# Altium project Vreg_Learning_Platform.PrjPcb (part 4 of 4)

## Sheet Safety.SchDoc: <Project Name>
size A3; ApprovedBy: <Appr.>; Author: <Author>; CompanyName: Infineon Technologies AG; Engineer: <Rel.>; Organization: Infineon Technologies AG; Address1: IFAG DES S PS; Address2: Am Campeon 1-12  -  85579 Neubiberg  -  Germany; Address3: 85579 Neubiberg; Address4: Germany; DocumentNumber: 6; Revision: <Rev.>; SheetNumber: 6; SheetTotal: 9; Release: RC00; PageSetup: Record=PageOptions|CenterHorizontal=True|CenterVertical=True|PrintScale=1.01|XCorrection=1.00|YCorrection=1.00|PrintKind=0|BorderSize=5000000|LeftOffset=0|BottomOffset=0|Orientation=2|PaperLength=1000|PaperWidth=1000|Scale=100|PaperSource=7|PrintQuality=-4|MediaType=1|DitherType=10|PaperKind=A3|PrintScaleMode=1; Doc_ConfidentialStatus: <Doc_ConfidentialStatus>; Doc_Preliminary: <Doc_Preliminary>
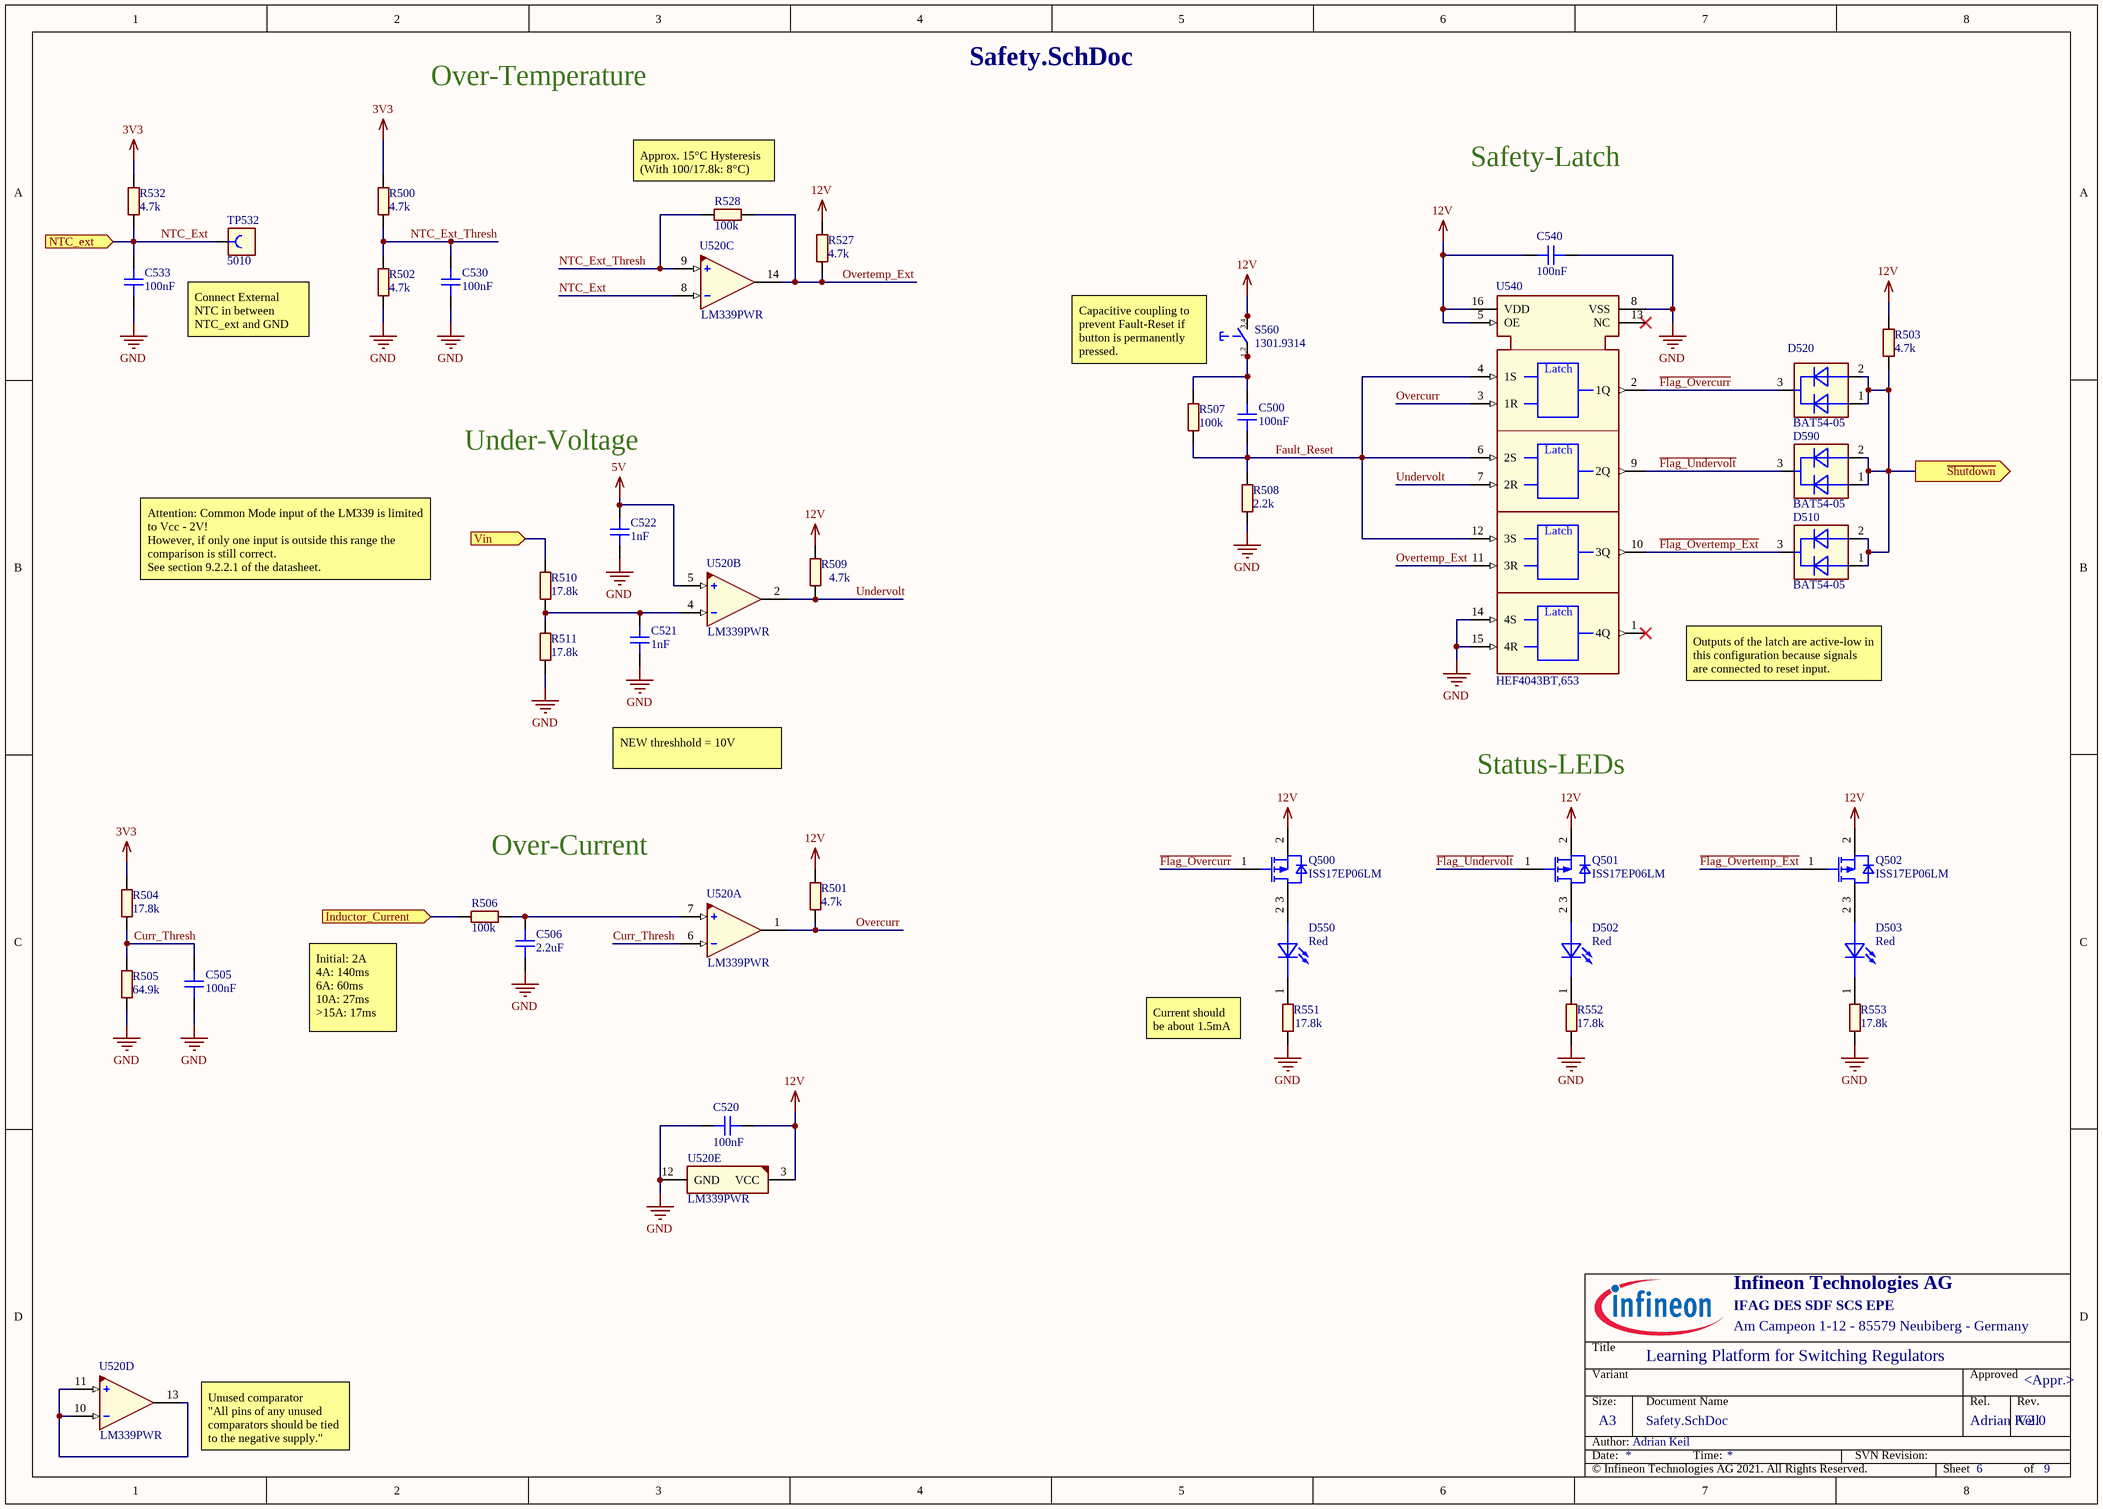
[diagram p4: Safety.SchDoc]

### Parts
C500  100nF  [CAPC1608X90N-2]
C505  100nF  [CAPC1608X90N-2]
C506  2.2uF  [CAPC1608X90N-3]
C520  100nF  [CAPC1608X90N-2]
C521  1nF  [CAPC1608X87N-1]
C522  1nF  [CAPC1608X87N-1]
C530  100nF  [CAPC1608X90N-2]
C533  100nF  [CAPC1608X90N-2]
C540  100nF  [CAPC1608X90N-2]
D502  Red  [LEDSC160X80X80-2N-1]
D503  Red  [LEDSC160X80X80-2N-1]
D510  BAT54-05  [SOT95P240X110-3N-1-V]
D520  BAT54-05  [SOT95P240X110-3N-1-V]
D550  Red  [LEDSC160X80X80-2N-1]
D590  BAT54-05  [SOT95P240X110-3N-1-V]
Q500  ISS17EP06LM  [SOT95P240X110-3N-1-V]
Q501  ISS17EP06LM  [SOT95P240X110-3N-1-V]
Q502  ISS17EP06LM  [SOT95P240X110-3N-1-V]
R500  4.7k  [RESC1609X55N]
R501  4.7k  [RESC1609X55N]
R502  4.7k  [RESC1609X55N]
R503  4.7k  [RESC1609X55N]
R504  17.8k  [RESC1608X60N]
R505  64.9k  [RESC1608X60N]
R506  100k  [RESC1508X60N]
R507  100k  [RESC1508X60N]
R508  2.2k  [RESC1609X50N]
R509  4.7k  [RESC1609X55N]
R510  17.8k  [RESC1608X60N]
R511  17.8k  [RESC1608X60N]
R527  4.7k  [RESC1609X55N]
R528  100k  [RESC1609X50N]
R532  4.7k  [RESC1609X55N]
R551  17.8k  [RESC1608X60N]
R552  17.8k  [RESC1608X60N]
R553  17.8k  [RESC1608X60N]
S560  1301.9314  [SW-SMD-1301.9314]
TP532  5010  [CON-THT-TP-5010]
U520  LM339PWR  [SOP65P640X120-14N-1]  (parts A,B,C,D,E of 5)
U540  HEF4043BT,653  [SOIC127P600X175-16N-6]

### Ports
Inductor_Current (in), NTC_ext (in), Vin (in), ~{Shutdown} (out)

### Nets
3V3: R500.2 R504.2 R532.2
5V: C522.2 U520.5(2IN_P)
12V: C520.1 C540.2 Q500.2(SOURCE) Q501.2(SOURCE) Q502.2(SOURCE) R501.2 R503.2 R509.2 R527.2 S560.3 S560.4 U520.3(VCC) U540.5(OE) U540.16(VDD)
GND: C505.1 C506.1 C520.2 C521.1 C522.1 C530.1 C533.1 C540.1 R502.1 R505.1 R508.2 R511.1 R551.2 R552.1 R553.1 U520.12(GND) U540.8(VSS) U540.14(4S) U540.15(4R)
~{Flag_Overcurr}: D520.3(CATHODE) Q500.1(GATE) U540.2(1Q)
~{Flag_Overtemp_Ext}: D510.3(CATHODE) Q502.1(GATE) U540.10(3Q)
~{Flag_Undervolt}: D590.3(CATHODE) Q501.1(GATE) U540.9(2Q)
~{Shutdown}: D510.1(ANODE_1) D510.2(ANODE_2) D520.1(ANODE_1) D520.2(ANODE_2) D590.1(ANODE_1) D590.2(ANODE_2) R503.1 ; port ~{Shutdown}
Curr_Thresh: C505.2 R504.1 R505.2 U520.6(1IN_N)
Fault_Reset: C500.2 R507.1 R508.1 U540.4(1S) U540.6(2S) U540.12(3S)
Inductor_Current: R506.1 ; port Inductor_Current
NTC_ext: C533.2 R532.1 TP532.1 U520.8(3IN_N) ; port NTC_ext
NTC_Ext_Thresh: C530.2 R500.1 R502.2 R528.2 U520.9(3IN_P)
Overcurr: R501.1 U520.1(1OUT) U540.3(1R)
Overtemp_Ext: R527.1 R528.1 U520.14(3OUT) U540.11(3R)
Undervolt: R509.1 U520.2(2OUT) U540.7(2R)
Vin: R510.1 ; port Vin
NetC500_1: C500.1 R507.2 S560.1 S560.2
NetC506_2: C506.2 R506.2 U520.7(1IN_P)
NetC521_2: C521.2 R510.2 R511.2 U520.4(2IN_N)
NetD502_1: D502.1(Cathode) R552.2
NetD502_2: D502.2(Anode) Q501.3(DRAIN)
NetD503_1: D503.1(Cathode) R553.2
NetD503_2: D503.2(Anode) Q502.3(DRAIN)
NetD550_1: D550.1(Cathode) R551.1
NetD550_2: D550.2(Anode) Q500.3(DRAIN)
NetU520_10: U520.10(4IN_N) U520.11(4IN_P) U520.13(4OUT)

Not connected (* = marked no-connect by the designer): U540 1(4Q)* 13(NC)*

### Notes on the sheet
- Over-Temperature
- (near R528) Approx. 15°C Hysteresis
  (With 100/17.8k: 8°C)
- Safety-Latch
- Connect External NTC in between NTC_ext and GND
- Capacitive coupling to prevent Fault-Reset if button is permanently pressed.
- Under-Voltage
- Attention: Common Mode input of the LM339 is limited to Vcc - 2V!
  However, if only one input is outside this range the comparison is still correct.
  See section 9.2.2.1 of the datasheet.
- Outputs of the latch are active-low in this configuration because signals  are connected to reset input.
- NEW threshhold = 10V
- Status-LEDs
- Over-Current
- Initial: 2A
  4A: 140ms
  6A: 60ms
  10A: 27ms
  >15A: 17ms
- Current should be about 1.5mA
- (near U520) Unused comparator
  "All pins of any unused comparators should be tied to the negative supply."
- Title
- Variant
- Approved
- Date:
- Author:
- Size:
- A3
- Document Name
- Time:
- SVN Revision:
- Rel.
- Rev.
- Sheet
- of
- (in symbol 380147) 3,4; 1,2
- (in symbol 648079) Latch

### Library data of the parts
C500 C505 C520 C530 C533 C540 = 479045: CAP / CERA / 100nF / 50V / 10% / X7R (EIA) / -55°C to 125°C / 0603 / SMD / -; Multiple Parts: No; Manufacturer: AVX; Manufacturer Order Number: 06035C104KAT2A; Symbol Type: Capacitor; Single; Standard; 2 Pins; Alternate View: Yes; Article Number: 479045; Version Number: V01; Combined Parameters: TC:X7R (EIA);Tol.:-10%/+10%;Vdc:50V; QuickPick: 100nF / 50V / 10% / X7R (EIA) / 0603; Type: Standard; Style: Single; ComponentStatus: Released; PLMStatus: Active; Part Type: Capacitor; Value: 100nF; Tolerance Neg: 10%; Tolerance Pos: 10%; Application: Standard; Technology: Ceramic; Temperature min: -55; Temperature max: 125; Temperature Range: Military; ROHS Compliant: Y; Automotive Qualified: No; PackageReference: 0603; ComponentLink1Description: Vendor WebSite; ComponentLink1URL: http://www.avx.com; ComponentLink2Description: Datasheet; ComponentLink2URL: http://webnetprod.muc.infineon.com/PCBPortal_Prod/WorkFlows/AltiumComponent/StandardDocumentation?Versionid=479046; Supplier 1: Farnell; Supplier Part Number 1: 2280883; Supplier 2: DigiKey; Supplier Part Number 2: 478-5052-2-ND; Supplier 3: Mouser; Supplier Part Number 3: 581-06035C104KAT2A; Second Source allowed: Yes; Voltage DC (max): 50V; Package Description: Capacitor,non-polarized,Chip;1.60mm L X 0.81mm W X 0.90mm H
C506 = 310650: CAP / CERA / 2.2uF / 25V / 10% / X5R (EIA) / -55°C to 85°C / 0603(1608) / SMD / -; Multiple Parts: No; Legacy PartNumber: CAP01010924; Manufacturer: MuRata; Manufacturer Order Number: GRM188R61E225KA12D; Symbol Type: Capacitor; Single; Standard; 2 Pins; Alternate View: Yes; Article Number: 310650; Version Number: V01; Combined Parameters: TC:X5R (EIA);Tol.:-10%/+10%;Vdc:25V; QuickPick: 2.2uF / 25V / 10% / X5R (EIA) / 0603 (1608M); Type: Standard; Style: Single; Package Metric: 1608; Package Imperial: 0603; ComponentStatus: Released; PLMStatus: Active; Legacy DeviceID: CAP01010924; Part Type: Capacitor; Value: 2.2uF; Tolerance Neg: 10%; Tolerance Pos: 10%; Technology: Ceramic; Temperature min: -55; Temperature max: 85; Temperature Range: Military; ROHS Compliant: Y; Automotive Qualified: No; PackageReference: 0603 (1608M); ComponentLink1Description: Vendor WebSite; ComponentLink1URL: http://www.murata.com/; ComponentLink2Description: Datasheet; ComponentLink2URL: http://webnetprod.muc.infineon.com/PCBPortal_Prod/WorkFlows/AltiumComponent/StandardDocumentation?Versionid=310651; Supplier 1: Farnell; Supplier Part Number 1: 1845734RL; Supplier 2: DigiKey; Supplier Part Number 2: 490-10731-2-ND; Supplier 3: Mouser; Supplier Part Number 3: 81-GRM188R61E225KA2D; Second Source allowed: Yes; Voltage DC (max): 25V; Package Description: Capacitor,non-polarized,Chip;1.60mm L X 0.80mm W X 0.90mm H
C521 C522 = 527788: CAP / CERA / 1nF / 50V / 10% / X7R (EIA) / -55°C to 125°C / 0603 (1608) / SMD / -; Multiple Parts: No; Manufacturer: Wurth Elektronik; Manufacturer Order Number: 885012206083; Symbol Type: Capacitor; Single; Standard; 2 Pins; Alternate View: Yes; Article Number: 527788; Version Number: V01; Combined Parameters: TC:X7R (EIA);Tol.:-10%/+10%;Vdc:50V; QuickPick: 1nF / 50V / 10% / X7R (EIA) / 0603 (1608); Type: Standard; Style: Single; ComponentStatus: Released; PLMStatus: Active; Part Type: Capacitor; Value: 1nF; Tolerance Neg: 10%; Tolerance Pos: 10%; Application: Standard; Technology: Ceramic; Temperature min: -55; Temperature max: 125; Temperature Range: Military; ROHS Compliant: Y; Automotive Qualified: No; PackageReference: 0603 (1608); ComponentLink1Description: Vendor WebSite; ComponentLink1URL: http://www.we-online.com; ComponentLink2Description: Datasheet; ComponentLink2URL: http://webnetprod.muc.infineon.com/PCBPortal_Prod/WorkFlows/AltiumComponent/StandardDocumentation?Versionid=527789; Supplier 1: Farnell; Supplier Part Number 1: 2495178; Supplier 2: DigiKey; Supplier Part Number 2: 732-8001-1-ND; Supplier 3: Mouser; Supplier Part Number 3: 710-885012206083; Second Source allowed: Yes; Voltage DC (max): 50V; Package Description: Capacitor,non-polarized,Chip;1.60mm L X 0.80mm W X 0.87mm H
D502 D503 D550 = 625459: WL-SMCW SMT Mono-color Chip LED Waterclear, Red,630nm; Manufacturer: Wurth Elektronik; Manufacturer Order Number: 150060RS75000; Symbol Type: Standard LED Symbol, 1 Cathode, 2 Anode; Article Number: 625459; Version Number: V01; Combined Parameters: Vf:2.4V;If:30mA;Ur:5V;Ir:10uA;Pmax:72mW; QuickPick: LED / 1608 (0603); Style: Single; Automotive Qualified: No; ComponentStatus: Released; PLMStatus: Active; Second Source allowed: Yes; Voltage DC (max): na; Part Type: Diode; Value: Red; Type: LED; Application: Standard; Temperature min: -40; Temperature max: 85; Temperature Range: Industrial; ROHS Compliant: Y; PackageReference: 1608 (0603); ComponentLink1Description: Vendor WebSite; ComponentLink1URL: http://www.we-online.com; ComponentLink2Description: Datasheet; ComponentLink2URL: http://webnetprod.muc.infineon.com/PCBPortal_Prod/WorkFlows/AltiumComponent/StandardDocumentation?Versionid=625460; Supplier 1: Farnell; Supplier Part Number 1: 2322071; Supplier 2: DigiKey; Supplier Part Number 2: 732-4978-1-ND; Supplier 3: Mouser; Supplier Part Number 3: 710-150060RS75000; Package Description: LED,Side Concave; 2 pin,1.60mm W X 0.80mm L X 0.80mm H
D510 D520 D590 = 430837: Silicon Schottky Diode, LS(nH) 1.8, VR 30V; Legacy PartNumber: IFX01401370; Manufacturer: Infineon Technologies; Symbol type: Dual Diode Symbol 3 Pins, 1 Anode, 2 Anode, 3 Cathode; Article Number: 430837; Version Number: V01; Combined Parameters: Vf:800mV;If:200mA;Ur:30V;Ir:2uA;Pmax:230mW; QuickPick: Schottky Diode / PG-SOT23-3-11; Style: Dual; Automotive Qualified: AEC Q101; ComponentStatus: Released; PLMStatus: Active; Second Source allowed: Yes; Voltage DC (max): na; Legacy DeviceID: IFX01401370; Part Type: Diode; Manufacturer Order Number: BAT54-05; Value: BAT54-05; Type: Schottky Diode; Application: Standard; Temperature min: 0; Temperature max: 150; Temperature Range: Military; ROHS Compliant: Y; PackageReference: PG-SOT23-3-11; ComponentLink1Description: Vendor WebSite; ComponentLink1URL: https://www.infineon.com/; ComponentLink2Description: Datasheet; ComponentLink2URL: http://webnetprod.muc.infineon.com/PCBPortal_Prod/WorkFlows/AltiumComponent/StandardDocumentation?Versionid=430838; Supplier 1: Farnell; Supplier Part Number 1: 2725759; Supplier 2: DigiKey; Supplier Part Number 2: BAT5405E6327HTSA1TR-ND; Supplier 3: Mouser; Supplier Part Number 3: 726-BAT5405E6327HTSA; Package Description: SOT,0.95mm pitch;3 pin,1.30mm W X 2.90mm L X 1.10mm H body
Q500-Q502 = 615536: OptiMOSTM Small Signal Transistor, -60 V; Manufacturer: Infineon Technologies; Symbol Type: Insulated-Gate Field-Effect Transistor (IGFET), P-Channel, Enhancement,  Body Diode, Pin 1 Gate, 2 Source, 3 Drain, 3 Pins; Article Number: 615536; Version Number: V01; Legacy DeviceID: IFX_ISS17EP06LM; Combined Parameters: P-Channel Enhancement;Uds:-60V;Id:-300mA;Rds:1.7R;P:360mW; QuickPick: P-Channel Enhancement / 360mW / -300mA / -60V / PG-SOT23-3-5; Type: P-Channel Enhancement; Style: Single; Automotive Qualified: No; ComponentStatus: Released; PLMStatus: Active; Second Source allowed: Yes; Voltage DC (max): na; Part Type: Transistor FET; Manufacturer Order Number: ISS17EP06LM; Value: ISS17EP06LM; Application: Small Signal; Temperature min: -55; Temperature max: 150; Temperature Range: Military; ROHS Compliant: Y; PackageReference: PG-SOT23-3-5; ComponentLink1Description: Vendor WebSite; ComponentLink1URL: https://www.infineon.com/; ComponentLink2Description: Datasheet; ComponentLink2URL: http://webnetprod.muc.infineon.com/PCBPortal_Prod/WorkFlows/AltiumComponent/StandardDocumentation?Versionid=615537; Supplier 1: Farnell; Supplier Part Number 1: 3267800; Supplier 2: DigiKey; Supplier Part Number 2: 448-ISS17EP06LMXTSA1CT-ND; Supplier 3: Mouser; Supplier Part Number 3: 726-ISS17EP06LMXTSA1; Package Description: SOT,0.95mm,pitch;3 pin,1.30mm W X 2.90mm L X 1.10mm H body
R500-R503 R509 R527 R532 = 699381: RES / STD / 4.7k / 100mW / 1% / 100ppm/K / -55°C to 155°C / 1.60mm L X 0.85mm W X 0.55mm H / - / -; Multiple Parts: No; Manufacturer: Panasonic; Manufacturer Order Number: ERJ3EKF4701V; Symbol Type: Resistor; Single; Standard; 2 Pins; Alternate View: Yes; Article Number: 699381; Version Number: V00; Combined Parameters: TCR:100ppm/K;Tol.:-1%/+1%;Vdc:-;Idc:-;P:100mW; QuickPick: 4.7k / 1% / 0.1 / ERJ3EKF4701V; Style: Single; Automotive Qualified: AEC Q200; ComponentStatus: Released; PLMStatus: Active; Part Type: Resistor; Value: 4.7k; Tolerance Neg: 1%; Tolerance Pos: 1%; Type: Standard; Application: Standard; Technology: Thick Film; Temperature min: -55; Temperature max: 155; Temperature Range: Military; ROHS Compliant: Y; PackageReference: ERJ3EKF4701V; ComponentLink1Description: Vendor WebSite; ComponentLink1URL: http://panasonic.net/sanyo/index.html; ComponentLink2Description: Datasheet; ComponentLink2URL: http://webnetprod.muc.infineon.com/PCBPortal_Prod/WorkFlows/AltiumComponent/StandardDocumentation?Versionid=699382; Supplier 1: Farnell; Supplier Part Number 1: 2303181; Supplier 2: DigiKey; Supplier Part Number 2: P4.70KHCT-ND; Supplier 3: Mouser; Supplier Part Number 3: 667-ERJ-3EKF4701V; Second Source allowed: Yes; Package Description: Resistor,Chip;1.60mm L X 0.85mm W X 0.55mm H
R504 R510 R511 R551-R553 = 699489: RES / STD / 17.8k / 100mW / 1% / 100ppm/K / -55°C to 155°C / 1.60mm L X 0.80mm W X 0.60mm H / - / -; Multiple Parts: No; Manufacturer: Multicomp; Manufacturer Order Number: MCWR06X1782FTL; Symbol Type: Resistor; Single; Standard; 2 Pins; Alternate View: Yes; Article Number: 699489; Version Number: V00; Combined Parameters: TCR:100ppm/K;Tol.:-1%/+1%;Vdc:-;Idc:-;P:100mW; QuickPick: 17.8k / 1% / 0.1 / MCWR06X1782FTL; Style: Single; ComponentStatus: Released; PLMStatus: Active; Part Type: Resistor; Value: 17.8k; Tolerance Neg: 1%; Tolerance Pos: 1%; Type: Standard; Application: Standard; Technology: Thick Film; Temperature min: -55; Temperature max: 155; Temperature Range: Military; ROHS Compliant: Y; Automotive Qualified: No; PackageReference: MCWR06X1782FTL; ComponentLink1Description: Vendor WebSite; ComponentLink1URL: http://www.farnellinone.com; ComponentLink2Description: Datasheet; ComponentLink2URL: http://webnetprod.muc.infineon.com/PCBPortal_Prod/WorkFlows/AltiumComponent/StandardDocumentation?Versionid=699490; Supplier 1: Farnell; Supplier Part Number 1: 2447265; Supplier 2: DigiKey; Supplier 3: Mouser; Second Source allowed: Yes; Package Description: Resistor,Chip;1.60mm L X 0.80mm W X 0.60mm H
R505 = 699501: RES / STD / 64.9k / 100mW / 1% / 100ppm/K / -55°C to 155°C / 1.60mm L X 0.80mm W X 0.60mm H / - / -; Multiple Parts: No; Manufacturer: Multicomp; Manufacturer Order Number: MCWR06X6492FTL; Symbol Type: Resistor; Single; Standard; 2 Pins; Alternate View: Yes; Article Number: 699501; Version Number: V00; Combined Parameters: TCR:100ppm/K;Tol.:-1%/+1%;Vdc:-;Idc:-;P:100mW; QuickPick: 64.9k / 1% / 0.1 / MCWR06X6492FTL; Style: Single; ComponentStatus: Released; PLMStatus: Active; Part Type: Resistor; Value: 64.9k; Tolerance Neg: 1%; Tolerance Pos: 1%; Type: Standard; Application: Standard; Technology: Thick Film; Temperature min: -55; Temperature max: 155; Temperature Range: Military; ROHS Compliant: Y; Automotive Qualified: No; PackageReference: MCWR06X6492FTL; ComponentLink1Description: Vendor WebSite; ComponentLink1URL: http://www.farnellinone.com; ComponentLink2Description: Datasheet; ComponentLink2URL: http://webnetprod.muc.infineon.com/PCBPortal_Prod/WorkFlows/AltiumComponent/StandardDocumentation?Versionid=699502; Supplier 1: Farnell; Supplier Part Number 1: 2447417RL; Supplier 2: DigiKey; Supplier 3: Mouser; Second Source allowed: Yes; Package Description: Resistor,Chip;1.60mm L X 0.80mm W X 0.60mm H
R506 R507 = 699383: RES / STD / 100k / 100mW / 0.1% / 25ppm/K / -55°C to 155°C / 1.55mm L X 0.80mm W X 0.60mm H / - / -; Multiple Parts: No; Manufacturer: Bourns; Manufacturer Order Number: CRT0603-BY-1003ELF; Symbol Type: Resistor; Single; Standard; 2 Pins; Alternate View: Yes; Article Number: 699383; Version Number: V00; Combined Parameters: TCR:25ppm/K;Tol.:-0.1%/+0.1%;Vdc:150V;Idc:-;P:100mW; QuickPick: 100k / 0.1% / 0.1 / CRT0603-BY-1003ELF; Style: Single; ComponentStatus: Released; PLMStatus: Active; Voltage DC (max): 150V; Part Type: Resistor; Value: 100k; Tolerance Neg: 0.1%; Tolerance Pos: 0.1%; Type: Standard; Application: Precision; Technology: Thin Film; Temperature min: -55; Temperature max: 155; Temperature Range: Military; ROHS Compliant: Y; Automotive Qualified: No; PackageReference: CRT0603-BY-1003ELF; ComponentLink1Description: Vendor WebSite; ComponentLink1URL: http://www.bourns.com; ComponentLink2Description: Datasheet; ComponentLink2URL: http://webnetprod.muc.infineon.com/PCBPortal_Prod/WorkFlows/AltiumComponent/StandardDocumentation?Versionid=699384; Supplier 1: Farnell; Supplier Part Number 1: 2008311; Supplier 2: DigiKey; Supplier Part Number 2: CRT0603-BY-1003ELFCT-ND; Supplier 3: Mouser; Supplier Part Number 3: 652-CRT0603BY1003ELF; Second Source allowed: Yes; Package Description: Resistor,Chip;1.55mm L X 0.80mm W X 0.60mm H
R508 = 345782: RES / STD / 2.2k / 100mW / 1% / 100ppm/K / -55°C to 155°C / 0603 / SMD / -; Multiple Parts: No; Legacy PartNumber: RES01801179; Manufacturer: Vishay; Manufacturer Order Number: CRCW06032K20FK; Symbol Type: Resistor; Single; Standard; 2 Pins; Alternate View: Yes; Article Number: 345782; Version Number: V01; Combined Parameters: TCR:100ppm/K;Tol.:-1%/+1%;Vdc:75V;Idc:-;P:100mW; QuickPick: 2.2k / 1% / 0.1 / 0603; Style: Single; Automotive Qualified: AEC Q200; ComponentStatus: Released; PLMStatus: Active; Voltage DC (max): 75V; Legacy DeviceID: RES01801179; Part Type: Resistor; Value: 2.2k; Tolerance Neg: 1%; Tolerance Pos: 1%; Type: Standard; Technology: Thick Film; Temperature min: -55; Temperature max: 155; Temperature Range: Military; ROHS Compliant: Y; PackageReference: 0603; ComponentLink1Description: Vendor WebSite; ComponentLink1URL: http://www.vishay.com; ComponentLink2Description: Datasheet; ComponentLink2URL: http://webnetprod.muc.infineon.com/PCBPortal_Prod/WorkFlows/AltiumComponent/StandardDocumentation?Versionid=345783; Supplier 1: Farnell; Supplier 2: DigiKey; Supplier 3: Mouser; Second Source allowed: Yes
R528 = 346742: RES / STD / 100k / 100mW / 1% / 100ppm/K / -55°C to 155°C / 0603 / SMD / -; Multiple Parts: No; Legacy PartNumber: RES01801371; Manufacturer: Vishay; Manufacturer Order Number: CRCW0603100KFK; Symbol Type: Resistor; Single; Standard; 2 Pins; Alternate View: Yes; Article Number: 346742; Version Number: V01; Combined Parameters: TCR:100ppm/K;Tol.:-1%/+1%;Vdc:75V;Idc:-;P:100mW; QuickPick: 100k / 1% / 0.1 / 0603; Style: Single; Automotive Qualified: AEC Q200; ComponentStatus: Released; PLMStatus: Active; Voltage DC (max): 75V; Legacy DeviceID: RES01801371; Part Type: Resistor; Value: 100k; Tolerance Neg: 1%; Tolerance Pos: 1%; Type: Standard; Technology: Thick Film; Temperature min: -55; Temperature max: 155; Temperature Range: Military; ROHS Compliant: Y; PackageReference: 0603; ComponentLink1Description: Vendor WebSite; ComponentLink1URL: http://www.vishay.com; ComponentLink2Description: Datasheet; ComponentLink2URL: http://webnetprod.muc.infineon.com/PCBPortal_Prod/WorkFlows/AltiumComponent/StandardDocumentation?Versionid=346743; Supplier 1: Farnell; Supplier Part Number 1: 1469649; Supplier 2: DigiKey; Supplier 3: Mouser; Second Source allowed: Yes
S560 = 380147: Pushbutton Tactile Switch, Single Pole Single Throw, 4 Pins; Legacy PartNumber: CON01500305; Manufacturer: Schurter; Symbol type: Tactile Switch, Spring Return, Single Pole Single Throw - Normally Open, 4 Pins; Article Number: 380147; Version Number: V01; Legacy DeviceID: SCH_1301.9314; ComponentStatus: Released; PLMStatus: Active; Second Source allowed: Yes; Voltage DC (max): na; Part Type: Electro Mechanic; Manufacturer Order Number: 1301.9314; Value: 1301.9314; Temperature min: -20; Temperature max: 70; Temperature Range: Commercial; ROHS Compliant: Y; ComponentLink1Description: Vendor WebSite; ComponentLink1URL: http://www.schurter.com.sg/; ComponentLink2Description: Datasheet; ComponentLink2URL: http://webnetprod.muc.infineon.com/PCBPortal_Prod/WorkFlows/AltiumComponent/StandardDocumentation?Versionid=380148; Supplier 1: Farnell; Supplier Part Number 1: 1217763; Supplier 2: DigiKey; Supplier Part Number 2: 1301.9314-ND; Supplier 3: Mouser; Supplier Part Number 3: 693-1301.9314; Package Description: SMD Switch, 6.00mm L X 6.00mm W X 4.3mm H body
TP532 = 382400: PC Test Point-Multipurpose THT, Red; Multiple Parts: No; Legacy PartNumber: CON01500529; Manufacturer: Keystone Electronics Corp.; Symbol Type: Connector, 1 Lead, Female; Alternate View: Yes; Article Number: 382400; Version Number: V01; Legacy DeviceID: KEY_5010; Combined Parameters: Board-to-Cable None (onboard);1x1;Mounting:THT;Orient:0° (vertical);Shielded:No; QuickPick: 0° (vertical) / Board-to-Cable; Style: Not Applicable; ComponentStatus: Released; PLMStatus: Active; Voltage DC (max): na; Part Type: Connector; Manufacturer Order Number: 5010; Value: 5010; Type: Board-to-Cable; Application: Test; Temperature min: 0; Temperature max: 0; Temperature Range: Military; ROHS Compliant: Y; Automotive Qualified: No; ComponentLink1Description: Vendor WebSite; ComponentLink1URL: http://www.keyelco.com/; ComponentLink2Description: Datasheet; ComponentLink2URL: http://webnetprod.muc.infineon.com/PCBPortal_Prod/WorkFlows/AltiumComponent/StandardDocumentation?Versionid=382401; Supplier 1: Farnell; Supplier Part Number 1: 2301288; Supplier 2: DigiKey; Supplier Part Number 2: 36-5010-ND; Supplier 3: Mouser; Supplier Part Number 3: 534-5010; Second Source allowed: Yes; Package Description: Test Point, 1.78 mm Lead Width, Round, 3.17 mm Dia X 8.28 mm H body
U520 = 409035: Quad Differential Comparator; Legacy PartNumber: IC02600564; Manufacturer: Texas Instruments; Alternate View: Yes; Article Number: 409035; Version Number: V01; Legacy DeviceID: TI_LM339; Combined Parameters: Res.:-;Fmax:-; QuickPick: TSSOP-14 (PW); Automotive Qualified: No; ComponentStatus: Released; PLMStatus: Active; Voltage DC (max): na; Symbol Type: Quad Differential Comparator; Part Type: Analog Parts; Manufacturer Order Number: LM339PWR; Value: LM339PWR; Temperature min: 0; Temperature max: 0; Temperature Range: Military; PackageReference: TSSOP-14 (PW); ComponentLink1Description: Vendor WebSite; ComponentLink1URL: http://www.ti.com; ComponentLink2Description: Datasheet; ComponentLink2URL: http://webnetprod.muc.infineon.com/PCBPortal_Prod/WorkFlows/AltiumComponent/StandardDocumentation?Versionid=409036; Supplier 1: Farnell; Supplier Part Number 1: 2436009; Supplier 2: DigiKey; Supplier Part Number 2: 296-6607-2-ND; Supplier 3: Mouser; Supplier Part Number 3: 595-LM339PWR; Second Source allowed: Yes
U540 = 648079: Quad R/S latch with 3-state outputs; Multiple Parts: No; Manufacturer: Nexperia; Article Number: 648079; Version Number: V00; Legacy DeviceID: NEX_HEF4043BT,653; Combined Parameters: - Digital;Vdc min/max:3V/15V;Iout:2.4mA;Fmax:-; QuickPick: SO-16; ComponentStatus: Released; PLMStatus: Active; Second Source allowed: Yes; Voltage DC (max): na; Symbol Type: Quad R/S latch with 3-state outputs; Alternate View: No; Part Type: Integrated Circuit; Manufacturer Order Number: HEF4043BT,653; Value: HEF4043BT,653; Type: Digital; Temperature min: -40; Temperature max: 85; Temperature Range: Industrial; ROHS Compliant: Y; Automotive Qualified: No; PackageReference: SO-16; ComponentLink1Description: Vendor WebSite; ComponentLink1URL: http://www.nexperia.com; ComponentLink2Description: Datasheet; ComponentLink2URL: http://webnetprod.muc.infineon.com/PCBPortal_Prod/WorkFlows/AltiumComponent/StandardDocumentation?Versionid=648080; Supplier 1: Farnell; Supplier 2: DigiKey; Supplier Part Number 2: 1727-1799-1-ND; Supplier 3: Mouser; Supplier Part Number 3: 771-HEF4043BT653; Package Description: SOIC,1.27mm pitch;16 pin,3.90mm W X 9.90mm L X 1.75mm H body

## Sheet Miscellaneous.SchDoc: <Project Name>
size A3; ApprovedBy: <Appr.>; Author: <Author>; CompanyName: Infineon Technologies AG; Engineer: <Rel.>; Organization: Infineon Technologies AG; Address1: IFAG DES S PS; Address2: Am Campeon 1-12  -  85579 Neubiberg  -  Germany; Address3: 85579 Neubiberg; Address4: Germany; DocumentNumber: 9; Revision: <Rev.>; SheetNumber: 9; SheetTotal: 9; Release: RC00; PageSetup: Record=PageOptions|CenterHorizontal=True|CenterVertical=True|PrintScale=1.01|XCorrection=1.00|YCorrection=1.00|PrintKind=0|BorderSize=5000000|LeftOffset=0|BottomOffset=0|Orientation=2|PaperLength=1000|PaperWidth=1000|Scale=100|PaperSource=7|PrintQuality=-4|MediaType=1|DitherType=10|PaperKind=A3|PrintScaleMode=1; Doc_ConfidentialStatus: <Doc_ConfidentialStatus>; Doc_Preliminary: <Doc_Preliminary>
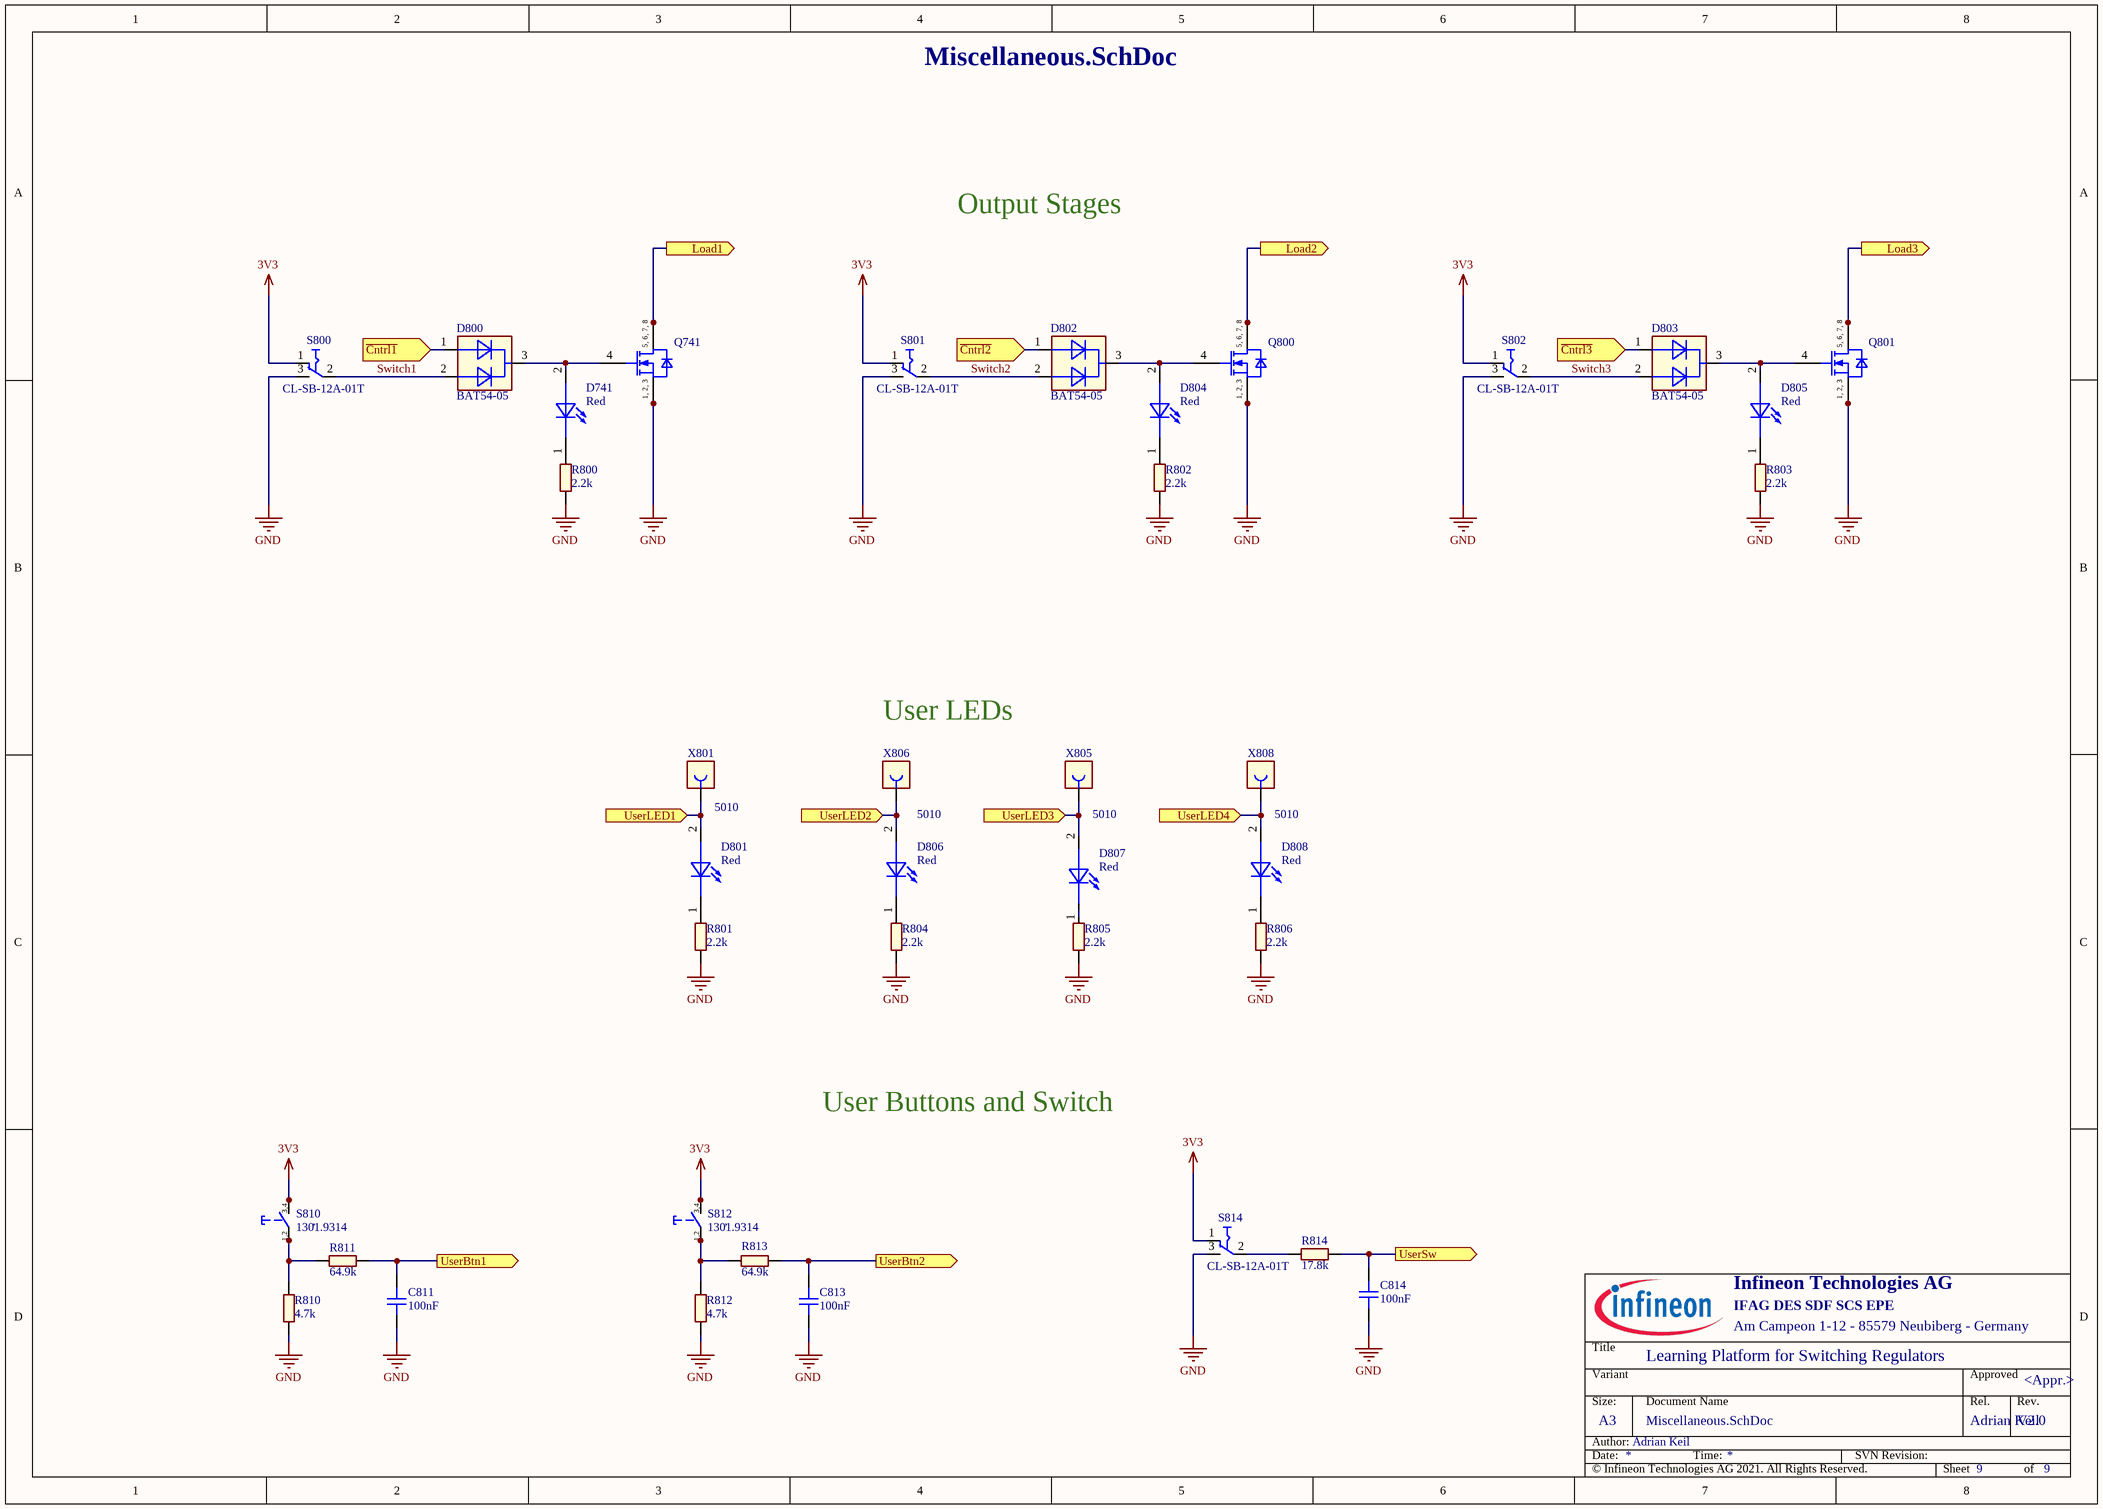
[diagram p5: Miscellaneous.SchDoc]

### Parts
C811  100nF  [CAPC1608X90N-2]
C813  100nF  [CAPC1608X90N-2]
C814  100nF  [CAPC1608X90N-2]
D741  Red  [LEDSC160X80X80-2N-1]
D800  BAT54-05  [SOT95P240X110-3N-1-V]
D801  Red  [LEDSC160X80X80-2N-1]
D802  BAT54-05  [SOT95P240X110-3N-1-V]
D803  BAT54-05  [SOT95P240X110-3N-1-V]
D804  Red  [LEDSC160X80X80-2N-1]
D805  Red  [LEDSC160X80X80-2N-1]
D806  Red  [LEDSC160X80X80-2N-1]
D807  Red  [LEDSC160X80X80-2N-1]
D808  Red  [LEDSC160X80X80-2N-1]
Q741  igfet_n_ch_enh_dio_1s2s3s4g5d6d7d8d_8p  [IFX-PG-TDSON-8-6-V]  (value not drawn)
Q800  igfet_n_ch_enh_dio_1s2s3s4g5d6d7d8d_8p  [IFX-PG-TDSON-8-6-V]  (value not drawn)
Q801  igfet_n_ch_enh_dio_1s2s3s4g5d6d7d8d_8p  [IFX-PG-TDSON-8-6-V]  (value not drawn)
R800  2.2k  [RESC1609X50N]
R801  2.2k  [RESC1609X50N]
R802  2.2k  [RESC1609X50N]
R803  2.2k  [RESC1609X50N]
R804  2.2k  [RESC1609X50N]
R805  2.2k  [RESC1609X50N]
R806  2.2k  [RESC1609X50N]
R810  4.7k  [RESC1609X55N]
R811  64.9k  [RESC1608X60N]
R812  4.7k  [RESC1609X55N]
R813  64.9k  [RESC1608X60N]
R814  17.8k  [RESC1608X60N]
S800  CL-SB-12A-01T  [SW-SMD-CL-SB-12A-01T]
S801  CL-SB-12A-01T  [SW-SMD-CL-SB-12A-01T]
S802  CL-SB-12A-01T  [SW-SMD-CL-SB-12A-01T]
S810  1301.9314  [SW-SMD-1301.9314]
S812  1301.9314  [SW-SMD-1301.9314]
S814  CL-SB-12A-01T  [SW-SMD-CL-SB-12A-01T]
X801  5010  [CON-THT-TP-5010]
X805  5010  [CON-THT-TP-5010]
X806  5010  [CON-THT-TP-5010]
X808  5010  [CON-THT-TP-5010]

### Ports
Load1 (out), Load2 (out), Load3 (out), UserBtn1 (out), UserBtn2 (out), UserLED1 (in), UserLED2 (in), UserLED3 (in), UserLED4 (in), UserSw (out), ~{Cntrl1} (in), ~{Cntrl2} (in), ~{Cntrl3} (in)

### Nets
3V3: S800.1 S801.1 S802.1 S810.3 S810.4 S812.3 S812.4 S814.1
GND: C811.1 C813.1 C814.1 Q741.1(SOURCE) Q741.2(SOURCE) Q741.3(SOURCE) Q800.1(SOURCE) Q800.2(SOURCE) Q800.3(SOURCE) Q801.1(SOURCE) Q801.2(SOURCE) Q801.3(SOURCE) R800.2 R801.2 R802.2 R803.2 R804.2 R805.2 R806.2 R810.2 R812.2 S800.3 S801.3 S802.3 S814.3
~{Cntrl1}: D800.1(ANODE_1) ; port ~{Cntrl1}
~{Cntrl2}: D802.1(ANODE_1) ; port ~{Cntrl2}
~{Cntrl3}: D803.1(ANODE_1) ; port ~{Cntrl3}
Load1: Q741.5(DRAIN) Q741.6(DRAIN) Q741.7(DRAIN) Q741.8(DRAIN) ; port Load1
Load2: Q800.5(DRAIN) Q800.6(DRAIN) Q800.7(DRAIN) Q800.8(DRAIN) ; port Load2
Load3: Q801.5(DRAIN) Q801.6(DRAIN) Q801.7(DRAIN) Q801.8(DRAIN) ; port Load3
Switch1: D800.2(ANODE_2) S800.2
Switch2: D802.2(ANODE_2) S801.2
Switch3: D803.2(ANODE_2) S802.2
UserBtn1: C811.2 R811.2 ; port UserBtn1
UserBtn2: C813.2 R813.2 ; port UserBtn2
UserLED1: D801.2(Anode) X801.1 ; port UserLED1
UserLED2: D806.2(Anode) X806.1 ; port UserLED2
UserLED3: D807.2(Anode) X805.1 ; port UserLED3
UserLED4: D808.2(Anode) X808.1 ; port UserLED4
UserSw: C814.2 R814.2 ; port UserSw
NetD741_1: D741.1(Cathode) R800.1
NetD741_2: D741.2(Anode) D800.3(CATHODE) Q741.4(GATE)
NetD801_1: D801.1(Cathode) R801.1
NetD802_3: D802.3(CATHODE) D804.2(Anode) Q800.4(GATE)
NetD803_3: D803.3(CATHODE) D805.2(Anode) Q801.4(GATE)
NetD804_1: D804.1(Cathode) R802.1
NetD805_1: D805.1(Cathode) R803.1
NetD806_1: D806.1(Cathode) R804.1
NetD807_1: D807.1(Cathode) R805.1
NetD808_1: D808.1(Cathode) R806.1
NetR810_1: R810.1 R811.1 S810.1 S810.2
NetR812_1: R812.1 R813.1 S812.1 S812.2
NetR814_1: R814.1 S814.2

### Notes on the sheet
- Output Stages
- User LEDs
- User Buttons and Switch
- ,
- Title
- Variant
- Approved
- Date:
- Author:
- Size:
- A3
- Document Name
- Time:
- SVN Revision:
- Rel.
- Rev.
- Sheet
- of
- (in symbol 380147) 3,4; 1,2
- (in symbol 691273) 5, 6, 7, 8; 1, 2, 3

### Library data of the parts
C811 C813 C814 = 479045: as C500 on sheet Safety; Part Type: Capacitor; Value: 100nF; Tolerance Neg: 10%; Tolerance Pos: 10%; Application: Standard; Technology: Ceramic; Temperature min: -55; Temperature max: 125; Temperature Range: Military; ROHS Compliant: Y; Automotive Qualified: No; PackageReference: 0603; ComponentLink1Description: Vendor WebSite; ComponentLink1URL: http://www.avx.com; ComponentLink2Description: Datasheet; ComponentLink2URL: http://webnetprod.muc.infineon.com/PCBPortal_Prod/WorkFlows/AltiumComponent/StandardDocumentation?Versionid=479046; Supplier 1: Farnell; Supplier Part Number 1: 2280883; Supplier 2: DigiKey; Supplier Part Number 2: 478-5052-2-ND; Supplier 3: Mouser; Supplier Part Number 3: 581-06035C104KAT2A; Second Source allowed: Yes; Voltage DC (max): 50V; Package Description: Capacitor,non-polarized,Chip;1.60mm L X 0.81mm W X 0.90mm H
D741 D801 D804-D808 = 625459: as D502 on sheet Safety; Part Type: Diode; Value: Red; Type: LED; Application: Standard; Temperature min: -40; Temperature max: 85; Temperature Range: Industrial; ROHS Compliant: Y; PackageReference: 1608 (0603); ComponentLink1Description: Vendor WebSite; ComponentLink1URL: http://www.we-online.com; ComponentLink2Description: Datasheet; ComponentLink2URL: http://webnetprod.muc.infineon.com/PCBPortal_Prod/WorkFlows/AltiumComponent/StandardDocumentation?Versionid=625460; Supplier 1: Farnell; Supplier Part Number 1: 2322071; Supplier 2: DigiKey; Supplier Part Number 2: 732-4978-1-ND; Supplier 3: Mouser; Supplier Part Number 3: 710-150060RS75000; Package Description: LED,Side Concave; 2 pin,1.60mm W X 0.80mm L X 0.80mm H
D800 D802 D803 = 430837: as D510 on sheet Safety; Legacy DeviceID: IFX01401370; Part Type: Diode; Manufacturer Order Number: BAT54-05; Value: BAT54-05; Type: Schottky Diode; Application: Standard; Temperature min: 0; Temperature max: 150; Temperature Range: Military; ROHS Compliant: Y; PackageReference: PG-SOT23-3-11; ComponentLink1Description: Vendor WebSite; ComponentLink1URL: https://www.infineon.com/; ComponentLink2Description: Datasheet; ComponentLink2URL: http://webnetprod.muc.infineon.com/PCBPortal_Prod/WorkFlows/AltiumComponent/StandardDocumentation?Versionid=430838; Supplier 1: Farnell; Supplier Part Number 1: 2725759; Supplier 2: DigiKey; Supplier Part Number 2: BAT5405E6327HTSA1TR-ND; Supplier 3: Mouser; Supplier Part Number 3: 726-BAT5405E6327HTSA; Package Description: SOT,0.95mm pitch;3 pin,1.30mm W X 2.90mm L X 1.10mm H body
Q741 Q800 Q801 = 691273: OptiMOS Power MOSFET, 30V; Manufacturer: Infineon Technologies; Manufacturer Order Number: BSC0906NS; Symbol Type: Insulated-Gate Field-Effect Transistor (IGFET), N-Channel, Enhancement, Body Diode, Pin 1 Source, 2 Source, 3 Source, 4 Gate, 5 Drain, 6 Drain, 7 Drain, 8 Drain, 8 Pins; Article Number: 691273; Version Number: V00; Legacy DeviceID: IFX_BSC0906NS; Value: BSC0906NS; Combined Parameters: N-Channel Enhancement;Uds:30V;Id:63A;Rds:4.5R;P:30W; QuickPick: N-Channel Enhancement / 30W / 63A / 30V / TDSON-8; Type: N-Channel Enhancement; Style: Single; Automotive Qualified: No; ComponentStatus: Released; PLMStatus: Active; Second Source allowed: Yes; Voltage DC (max): na; Part Type: Transistor FET; Application: Power Electronics; Temperature min: -55; Temperature max: 150; Temperature Range: Military; ROHS Compliant: Y; PackageReference: TDSON-8; ComponentLink1Description: Vendor WebSite; ComponentLink1URL: https://www.infineon.com/; ComponentLink2Description: Datasheet; ComponentLink2URL: http://webnetprod.muc.infineon.com/PCBPortal_Prod/WorkFlows/AltiumComponent/StandardDocumentation?Versionid=691274; Supplier 1: Farnell; Supplier Part Number 1: 2480745; Supplier 2: DigiKey; Supplier Part Number 2: BSC0906NSATMA1CT-ND; Supplier 3: Mouser; Supplier Part Number 3: 726-BSC0906NS; Package Description: PG-TDSON-8-6, SMD, 1.27 mm pitch, 8 pin, 5.90 mm W X 5.075 mm L X 1.20 mm H body
R800-R806 = 345782: as R508 on sheet Safety; Legacy DeviceID: RES01801179; Part Type: Resistor; Value: 2.2k; Tolerance Neg: 1%; Tolerance Pos: 1%; Type: Standard; Technology: Thick Film; Temperature min: -55; Temperature max: 155; Temperature Range: Military; ROHS Compliant: Y; PackageReference: 0603; ComponentLink1Description: Vendor WebSite; ComponentLink1URL: http://www.vishay.com; ComponentLink2Description: Datasheet; ComponentLink2URL: http://webnetprod.muc.infineon.com/PCBPortal_Prod/WorkFlows/AltiumComponent/StandardDocumentation?Versionid=345783; Supplier 1: Farnell; Supplier 2: DigiKey; Supplier 3: Mouser; Second Source allowed: Yes
R810 R812 = 699381: as R500 on sheet Safety; Part Type: Resistor; Value: 4.7k; Tolerance Neg: 1%; Tolerance Pos: 1%; Type: Standard; Application: Standard; Technology: Thick Film; Temperature min: -55; Temperature max: 155; Temperature Range: Military; ROHS Compliant: Y; PackageReference: ERJ3EKF4701V; ComponentLink1Description: Vendor WebSite; ComponentLink1URL: http://panasonic.net/sanyo/index.html; ComponentLink2Description: Datasheet; ComponentLink2URL: http://webnetprod.muc.infineon.com/PCBPortal_Prod/WorkFlows/AltiumComponent/StandardDocumentation?Versionid=699382; Supplier 1: Farnell; Supplier Part Number 1: 2303181; Supplier 2: DigiKey; Supplier Part Number 2: P4.70KHCT-ND; Supplier 3: Mouser; Supplier Part Number 3: 667-ERJ-3EKF4701V; Second Source allowed: Yes; Package Description: Resistor,Chip;1.60mm L X 0.85mm W X 0.55mm H
R811 R813 = 699501: as R505 on sheet Safety; Part Type: Resistor; Value: 64.9k; Tolerance Neg: 1%; Tolerance Pos: 1%; Type: Standard; Application: Standard; Technology: Thick Film; Temperature min: -55; Temperature max: 155; Temperature Range: Military; ROHS Compliant: Y; Automotive Qualified: No; PackageReference: MCWR06X6492FTL; ComponentLink1Description: Vendor WebSite; ComponentLink1URL: http://www.farnellinone.com; ComponentLink2Description: Datasheet; ComponentLink2URL: http://webnetprod.muc.infineon.com/PCBPortal_Prod/WorkFlows/AltiumComponent/StandardDocumentation?Versionid=699502; Supplier 1: Farnell; Supplier Part Number 1: 2447417RL; Supplier 2: DigiKey; Supplier 3: Mouser; Second Source allowed: Yes; Package Description: Resistor,Chip;1.60mm L X 0.80mm W X 0.60mm H
R814 = 699489: as R504 on sheet Safety; Part Type: Resistor; Value: 17.8k; Tolerance Neg: 1%; Tolerance Pos: 1%; Type: Standard; Application: Standard; Technology: Thick Film; Temperature min: -55; Temperature max: 155; Temperature Range: Military; ROHS Compliant: Y; Automotive Qualified: No; PackageReference: MCWR06X1782FTL; ComponentLink1Description: Vendor WebSite; ComponentLink1URL: http://www.farnellinone.com; ComponentLink2Description: Datasheet; ComponentLink2URL: http://webnetprod.muc.infineon.com/PCBPortal_Prod/WorkFlows/AltiumComponent/StandardDocumentation?Versionid=699490; Supplier 1: Farnell; Supplier Part Number 1: 2447265; Supplier 2: DigiKey; Supplier 3: Mouser; Second Source allowed: Yes; Package Description: Resistor,Chip;1.60mm L X 0.80mm W X 0.60mm H
S800-S802 S814 = 650099: Slid Switch, 12V, 200mA; Manufacturer: NIDEC COPAL ELECTRONICS, Inc.; Symbol Type: Switch, 2 Change Over 1 3, 3 Pins; Article Number: 650099; Version Number: V00; Automotive Qualified: No; ComponentStatus: Released; PLMStatus: Active; Second Source allowed: Yes; Voltage DC (max): na; Part Type: Electro Mechanic; Manufacturer Order Number: CL-SB-12A-01T; Value: CL-SB-12A-01T; Application: Power; Temperature min: -40; Temperature max: 85; Temperature Range: Industrial; ROHS Compliant: Y; ComponentLink1Description: Vendor WebSite; ComponentLink1URL: www.copal-electronics.com/; ComponentLink2Description: Datasheet; ComponentLink2URL: http://webnetprod.muc.infineon.com/PCBPortal_Prod/WorkFlows/AltiumComponent/StandardDocumentation?Versionid=650100; Supplier 1: Farnell; Supplier Part Number 1: 2854744; Supplier 2: DigiKey; Supplier Part Number 2: 563-1314-1-ND; Supplier 3: Mouser; Supplier Part Number 3: 229-CL-SB-12A-01T; Package Description: Switch, SMD, 3 Pins, 3.50 mm W X 8.50 mm L X 6.10 mm H body
S810 S812 = 380147: as S560 on sheet Safety; Part Type: Electro Mechanic; Manufacturer Order Number: 1301.9314; Value: 1301.9314; Temperature min: -20; Temperature max: 70; Temperature Range: Commercial; ROHS Compliant: Y; ComponentLink1Description: Vendor WebSite; ComponentLink1URL: http://www.schurter.com.sg/; ComponentLink2Description: Datasheet; ComponentLink2URL: http://webnetprod.muc.infineon.com/PCBPortal_Prod/WorkFlows/AltiumComponent/StandardDocumentation?Versionid=380148; Supplier 1: Farnell; Supplier Part Number 1: 1217763; Supplier 2: DigiKey; Supplier Part Number 2: 1301.9314-ND; Supplier 3: Mouser; Supplier Part Number 3: 693-1301.9314; Package Description: SMD Switch, 6.00mm L X 6.00mm W X 4.3mm H body
X801 X805 X806 X808 = 382400: as TP532 on sheet Safety; Part Type: Connector; Manufacturer Order Number: 5010; Value: 5010; Type: Board-to-Cable; Application: Test; Temperature min: 0; Temperature max: 0; Temperature Range: Military; ROHS Compliant: Y; Automotive Qualified: No; ComponentLink1Description: Vendor WebSite; ComponentLink1URL: http://www.keyelco.com/; ComponentLink2Description: Datasheet; ComponentLink2URL: http://webnetprod.muc.infineon.com/PCBPortal_Prod/WorkFlows/AltiumComponent/StandardDocumentation?Versionid=382401; Supplier 1: Farnell; Supplier Part Number 1: 2301288; Supplier 2: DigiKey; Supplier Part Number 2: 36-5010-ND; Supplier 3: Mouser; Supplier Part Number 3: 534-5010; Second Source allowed: Yes; Package Description: Test Point, 1.78 mm Lead Width, Round, 3.17 mm Dia X 8.28 mm H body

## Nets that join several sheets
3V3: 02_Top_Level (D100.3 R160.3 R170.2 X140.4), PowerStage (6 pins), PowerSupply (C311.2 C312.2 G310.4), Safety (R500.2 R504.2 R532.2), Miscellaneous (8 pins)
5V: 02_Top_Level (D112.2 X140.3), PowerSupply (6 pins), Safety (C522.2 U520.5)
12V: 02_Top_Level (X140.2), Input (C630.2 U630.7), PowerStage (C400.2 U400.1), PowerSupply (C301.2 G300.14 R301.1), Safety (14 pins)
GND: 02_Top_Level (22 pins), Input (15 pins), PowerStage (24 pins), PowerSupply (19 pins), Safety (19 pins), Miscellaneous (25 pins)
~{Cntrl1}: 02_Top_Level (R100.1 X110.4D), Miscellaneous (D800.1)
~{Cntrl2}: 02_Top_Level (R101.1 X110.5D), Miscellaneous (D802.1)
~{Cntrl3}: 02_Top_Level (R102.1 X110.6D), Miscellaneous (D803.1)
~{Shutdown}: 02_Top_Level (R112.1), PowerStage (U400.3), Safety (7 pins)
Buck_Cntrl: 02_Top_Level (JP122.2 R122.1), PowerStage (TP400.1 U400.2)
Inductor_Current: 02_Top_Level (R111.2 X140.7), PowerStage (TP600.1 U420.5 U421.5), Safety (R506.1)
Input_Current: 02_Top_Level (R110.2 X140.6), Input (R634.2 TP630.1 U630.6)
Load1: 02_Top_Level (X150.3 X150.4), Miscellaneous (Q741.5 Q741.6 Q741.7 Q741.8)
Load2: 02_Top_Level (X150.5 X150.6), Miscellaneous (Q800.5 Q800.6 Q800.7 Q800.8)
Load3: 02_Top_Level (X150.7 X150.8), Miscellaneous (Q801.5 Q801.6 Q801.7 Q801.8)
NetQ200_2: 02_Top_Level (X100.1 X100.2), Input (Q200.2)
NTC_ext: 02_Top_Level (X110.6B X150.9), Safety (C533.2 R532.1 TP532.1 U520.8)
UserBtn1: 02_Top_Level (X110.3D), Miscellaneous (C811.2 R811.2)
UserBtn2: 02_Top_Level (X110.8D), Miscellaneous (C813.2 R813.2)
UserLED1: 02_Top_Level (X110.2C), Miscellaneous (D801.2 X801.1)
UserLED2: 02_Top_Level (X110.3C), Miscellaneous (D806.2 X806.1)
UserLED3: 02_Top_Level (X110.4C), Miscellaneous (D807.2 X805.1)
UserLED4: 02_Top_Level (X110.6C), Miscellaneous (D808.2 X808.1)
UserSw: 02_Top_Level (X110.5C), Miscellaneous (C814.2 R814.2)
Vin: 02_Top_Level (X140.1), Input (7 pins), PowerStage (5 pins), PowerSupply (7 pins), Safety (R510.1)
Vin_Meas: 02_Top_Level (X110.4B), Input (C221.2 R220.2 R221.1)
Vout: 02_Top_Level (5 pins), PowerStage (10 pins)
Vout_Meas: 02_Top_Level (X110.5B X140.9), PowerStage (R721.1 R722.1 X400.1)

## Assembly variants
Default_Assembly: not fitted C312 C511 C515 C521 C522 C600 C? JP421 MP100 MP100 MP101 MP101 MP102 MP102 MP103 MP103 R213 TP611 U420 U421 X110 X?
OnlySMD: not fitted C210 C312 C511 C515 C521 C522 C600 JP110 JP110 JP111 JP111 JP111 JP112 JP120 JP121 JP122 JP122 JP123 JP124 JP125 JP126 JP127 JP128 JP130 JP212 JP421 JP421 JP421 JP701 JP710 JP710 JP710 JP710 JP710 JP723 MP100 MP100 MP101 MP101 MP102 MP102 MP103 MP103 R213 R509 R513 TP100 TP100 TP101 TP101 TP102 TP102 TP103 TP103 TP103 TP104 TP104 TP105 TP105 TP106 TP107 TP202 TP300 TP421 TP421 TP503 TP611 TP710 TP802 U420 U421 X100 X101 X110 X110 X140 X140 X140 X140 X140 X140 X140 X150 X150 X720 X720 X720 X?